# EAGLE design patch_nrd_ard (EAGLE 6.5.0)
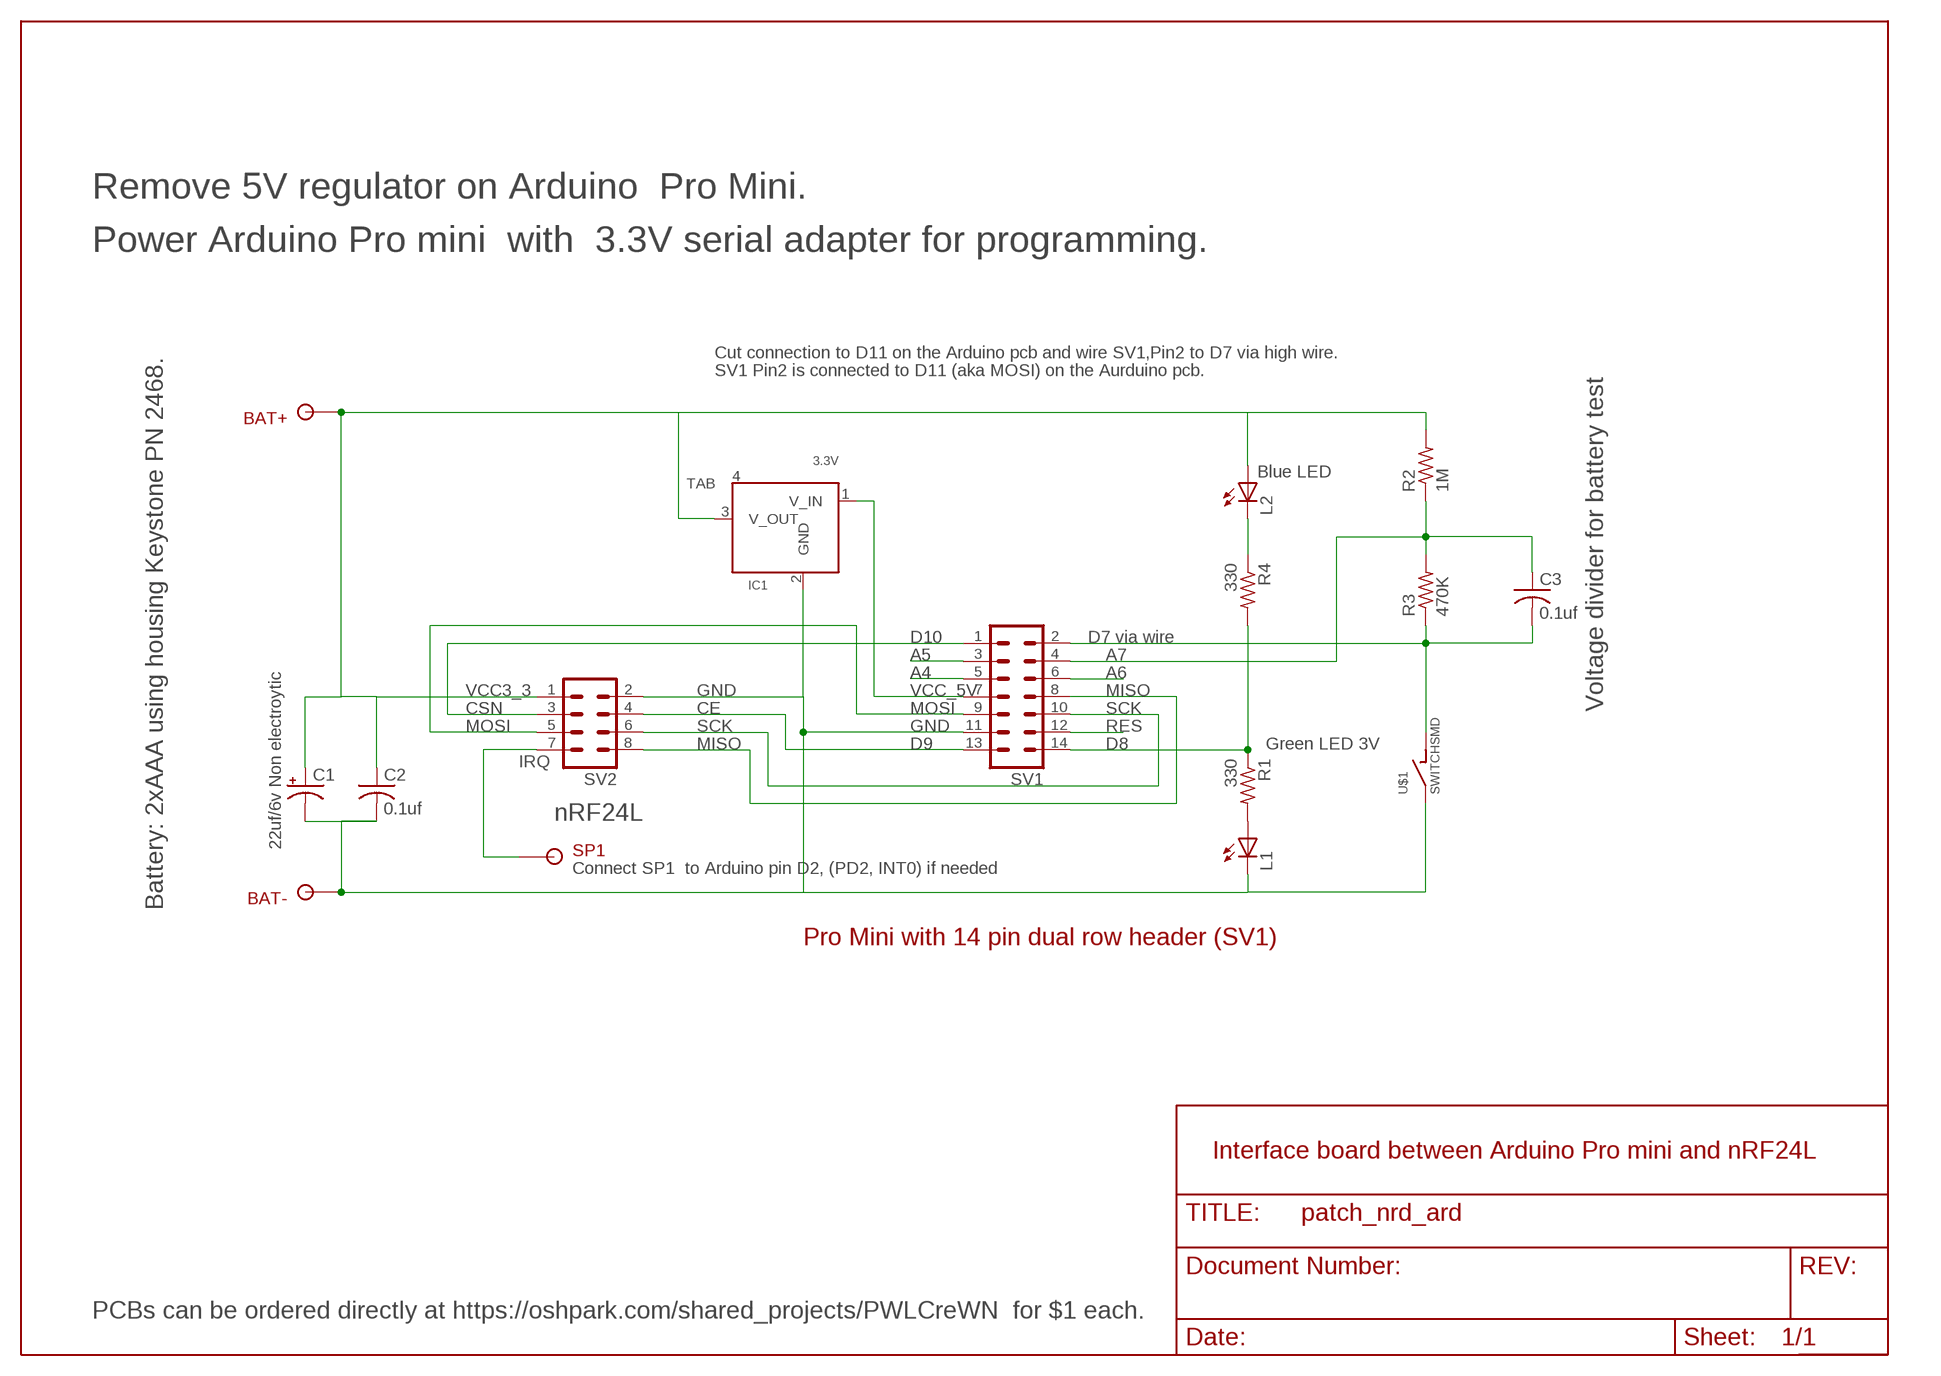
[diagram p0: schematic, sheet 1]

## Parts
BAT+  SOLDER_POINTA  [P1-13]
BAT-  SOLDER_POINTA  [P1-13]
C1  22uf/6v Non electroytic  CPOL-USSMCB  [SMC_B]
C2  0.1uf  C-USC0805  [C0805]
C3  0.1uf  C-USC0805  [C0805]
IC1  3.3V  MCP1703ASOT223  [SOT223]
L1  LEDSML0603  [SML0603]
L2  LEDSML0603  [SML0603]
R1  330  R-US_R0603  [R0603]
R2  1M  R-US_R0603  [R0603]
R3  470K  R-US_R0603  [R0603]
R4  330  R-US_R0603  [R0603]
SP1  SOLDER_POINTA  [P1-13]
SV1  MA07-2  [MA07-2]
SV2  MA04-2  [MA04-2]
U$1  SWITCHSMD  [SMD_SWITCH]

## Nets
A4: SV1.5
A5: SV1.3
A6: SV1.6
A7: C3.1 R2.1 R3.2 SV1.4
CE: SV1.13 SV2.4
CSN: SV1.1 SV2.3
D8: R1.1 R4.2 SV1.14
D11: C3.2 R3.1 SV1.2 U$1.P$1
GND: BAT-.1 C1.- C2.2 IC1.2(GND) L1.C SV1.11 SV2.2 U$1.P$2
IRQ: SP1.1 SV2.7
MISO: SV1.8 SV2.8
MOSI: SV1.9 SV2.5
N$1: L1.A R1.2
N$2: L2.C R4.1
RES: SV1.12
SCK: SV1.10 SV2.6
VCC3_3: BAT+.1 C1.+ C2.1 IC1.3(V_OUT) L2.A R2.2 SV2.1
VCC_5V: IC1.1(V_IN) SV1.7
Unconnected: IC1.4(TAB)

## Notes on the sheet
- Remove 5V regulator on Arduino  Pro Mini.
- Power Arduino Pro mini  with  3.3V serial adapter for programming.
- Cut connection to D11 on the Arduino pcb and wire SV1,Pin2 to D7 via high wire.
- SV1 Pin2 is connected to D11 (aka MOSI) on the Aurduino pcb. | Voltage divider for battery test
- Blue LED
- D10 | D7 via wire
- D9 | Green LED 3V
- nRF24L
- Connect SP1  to Arduino pin D2, (PD2, INT0) if needed
- Battery: 2xAAA using housing Keystone PN 2468.
- Pro Mini with 14 pin dual row header (SV1)
- Interface board between Arduino Pro mini and nRF24L
- PCBs can be ordered directly at https://oshpark.com/shared_projects/PWLCreWN  for $1 each.

## Library data of the parts
BAT+ BAT- SP1 = 1AA_Stofer:SOLDER_POINT
C1 = rcl:CPOL-US: POLARIZED CAPACITOR, American symbol
C2 C3 = rcl:C-US: CAPACITOR, American symbol
IC1 = 1AA_Stofer:MCP1703A
L1 L2 = led:LED: LED OSRAM: - CHIPLED LG R971, LG N971, LY N971, LG Q971, LY Q971, LO R971, LY R971 LH N974, LH R974 LS Q976, LO Q976, LY Q976 LO Q996 - Hyper CHIPLED LW Q18S LB Q993, LB Q99A, LB R99A - SideLED LS A670, LO A670, LY A670, LG A670, LP A670 LB A673, LV A673, LT A673, LW A673 LH A674 LY A675 LS A676, LA A676, LO A676, LY A676, LW A676 LS A679, LY A679, LG A679 - Hyper Micro SIDELED® LS Y876, LA Y876, LO Y876, LY Y876 LT Y87S - SmartLED LW L88C, LW L88S LB L89C, LB L89S, LG L890 LS L89K, LO L89K, LY L89K LS L896, LA L896, LO L896, LY L896 - TOPLED LS T670, LO T670, LY T670, LG T670, LP T670 LSG T670, LSP T670, LSY T670, LOP T670, LYG T670 LG T671, LOG T671, LSG T671 LB T673, LV T673, LT T673, LW T673 LH T674 LS T676, LA T676, LO T676, LY T676, LB T676, LH T676, LSB T676, LW T676 LB T67C, LV T67C, LT T67C, LS T67K, LO T67K, LY T67K, LW E67C LS E67B, LA E67B, LO E67B, LY E67B, LB E67C, LV E67C, LT E67C LW T67C LS T679, LY T679, LG T679 LS T770, LO T770, LY T770, LG T770, LP T770 LB T773, LV T773, LT T773, LW T773 LH T774 LS E675, LA E675, LY E675, LS T675 LS T776, LA T776, LO T776, LY T776, LB T776 LHGB T686 LT T68C, LB T68C - Hyper Mini TOPLED® LB M676 - Mini TOPLED Santana® LG M470 LS M47K, LO M47K, LY M47K Source: http://www.osram.convergy.de LUXEON: - LUMILED® LXK2-PW12-R00, LXK2-PW12-S00, LXK2-PW14-U00, LXK2-PW14-V00 LXK2-PM12-R00, LXK2-PM12-S00, LXK2-PM14-U00 LXK2-PE12-Q00, LXK2-PE12-R00, LXK2-PE12-S00, LXK2-PE14-T00, LXK2-PE14-U00 LXK2-PB12-K00, LXK2-PB12-L00, LXK2-PB12-M00, LXK2-PB14-N00, LXK2-PB14-P00, LXK2-PB14-Q00 LXK2-PR12-L00, LXK2-PR12-M00, LXK2-PR14-Q00, LXK2-PR14-R00 LXK2-PD12-Q00, LXK2-PD12-R00, LXK2-PD12-S00 LXK2-PH12-R00, LXK2-PH12-S00 LXK2-PL12-P00, LXK2-PL12-Q00, LXK2-PL12-R00 Source: www.luxeon.com KINGBRIGHT: KA-3528ASYC Source: www.kingbright.com
R1-R4 = rcl:R-US_: RESISTOR, American symbol
SV1 = con-lstb:MA07-2: PIN HEADER; OC_FARNELL: unknown; OC_NEWARK: unknown
SV2 = con-lstb:MA04-2: PIN HEADER; OC_FARNELL: unknown; OC_NEWARK: unknown
U$1 = 1AA_Stofer:SWITCH

## Board
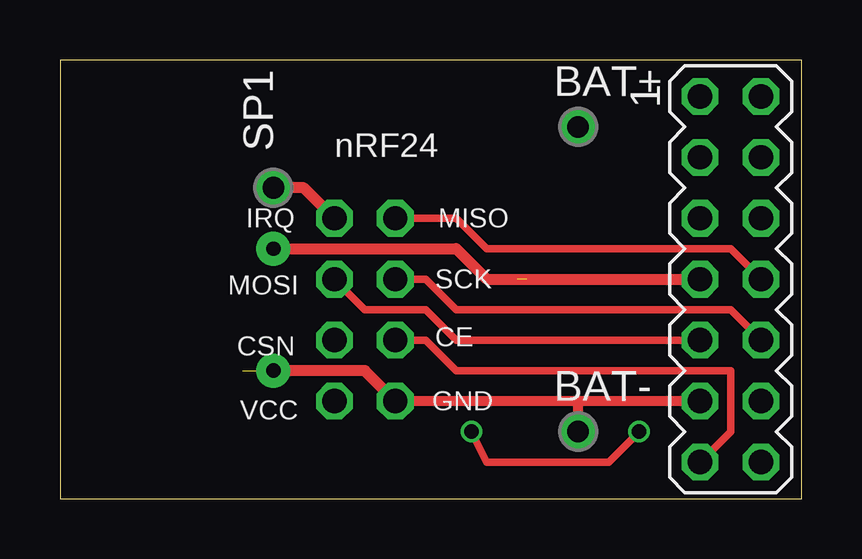
[diagram p1: board, top side]
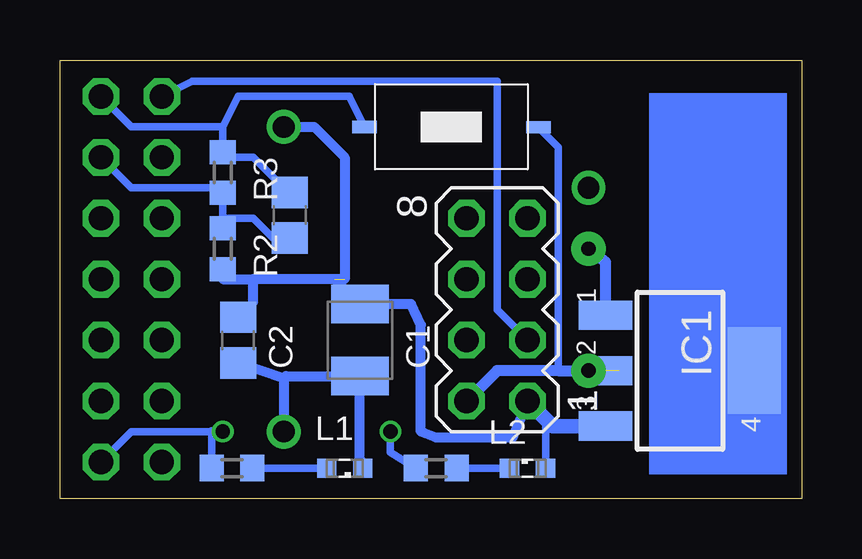
[diagram p2: board, bottom side, seen from below]

Size 30.91 x 18.28 mm. Coordinates in mm from the lower left corner, seen from the top.
Outline: 0,0 30.91,0 30.91,18.28 0,18.28 0,0
Copper layers (1*16): Top 0.035mm / dielectric 1.5mm / Bottom 0.035mm
Design rules "Elecrow_2-layer_eagle_rule": minimum track width 6mil, minimum drill 12mil, track to track 6mil, track to pad 6mil, pad to pad 6mil, via to via 6mil, smd to smd 0mil, copper to edge 10mil, drill to drill 10mil, minimum pad ring 10mil, minimum via ring 6mil, stop-mask expansion 2mil, vias tented up to drill 100mil, thermal gap 10mil

### Footprints (pad centres in the part's own frame; a part is rotated, then mirrored left to right if it is on the bottom)
P1-13 = drill 0.9: 1 0,0
SMC_B = smd 1.6 x 2.4: + -1.5,0; - 1.5,0
C0805 = smd 1.3 x 1.5: 1 -0.95,0; 2 0.95,0
SOT223 = smd 1.219 x 2.235: 1 -2.311,-3.099; 2 0,-3.099; 3 2.311,-3.099 | smd 3.6 x 2.2: 4 0,3.099
SML0603 = smd 0.8 x 0.8: A 0.75,0; C -0.75,0
R0603 = smd 1 x 1.1: 1 -0.85,0; 2 0.85,0
MA07-2 = drill 1.016 octagon: 1 -7.62,-1.27; 2 -7.62,1.27; 3 -5.08,-1.27; 4 -5.08,1.27; 5 -2.54,-1.27; 6 -2.54,1.27; 7 0,-1.27; 8 0,1.27; 9 2.54,-1.27; 10 2.54,1.27; 11 5.08,-1.27; 12 5.08,1.27; 13 7.62,-1.27; 14 7.62,1.27
MA04-2 = drill 1.016 octagon: 1 -3.81,-1.27; 2 -3.81,1.27; 3 -1.27,-1.27; 4 -1.27,1.27; 5 1.27,-1.27; 6 1.27,1.27; 7 3.81,-1.27; 8 3.81,1.27
SMD_SWITCH = smd 1.016 x 0.508: P$1 -4.259,-0.005; P$2 2.988,-0.021

### Placement (x,y rotation side)
BAT+  21.59,15.49 0 top
BAT-  21.59,2.79 0 top
C1  18.41,6.6 270 bottom
C2  23.49,6.6 270 bottom
C3  21.34,11.81 90 bottom
IC1  5.08,5.33 270 bottom
L1  19.05,1.27 180 bottom
L2  11.43,1.27 0 bottom
R1  23.75,1.27 0 bottom
R2  24.13,10.41 270 bottom
R3  24.13,13.59 270 bottom
R4  15.24,1.27 180 bottom
SP1  8.89,12.95 0 top
SV1  27.94,9.14 270 top
SV2  12.7,7.87 90 bottom
U$1  13.97,15.49 0 bottom

### Tracks (layer width: path | path; a pad name or v marks a point on that pad's centre or on a via)
A7
  Bottom 0.305: R2.1 24.13,11.68 | 24.13,11.68 R3.2 24.34,12.95 27.94,12.95 SV1.4 | 24.13,11.68 22.86,11.68 21.59,10.41 21.34,10.67 C3.1
CE
  Top 0.305: SV1.13 27.94,2.79 27.94,5.33 16.51,5.33 15.24,6.6 SV2.4
CSN
  Bottom 0.305: SV1.1 25.4,17.4 12.7,17.4 12.7,7.87 SV2.3
D8  (via drill 0.6)
  Top 0.305: v17.14,2.79 17.78,1.52 22.86,1.52 v24.13,2.79
  Bottom 0.305: R4.2 17.14,1.94 v17.14,2.79 | R1.1 24.6,2.83 v24.13,2.79 27.94,2.79 SV1.14
D11
  Bottom 0.305: 24.13,15.49 R3.1 23.91,14.22 22.86,14.22 21.4,12.76 C3.2 | 24.13,15.49 27.94,15.49 SV1.2 | U$1.P$1 18.87,16.76 23.49,16.76 24.13,15.49
GND  (via drill 0.6 pad 1.42)  (1 unrouted)
  Top 0.406: BAT-.1 21.59,4.06 | 21.59,4.06 SV2.2 | SV1.11 21.59,4.06
  Top 0.457: SV2.2 12.7,5.33 v8.89,5.33
  Bottom 0.305: U$1.P$2 10.16,14.65 10.16,5.33 | C1.- 18.41,4.06
  Bottom 0.406: C2.2 21.59,5.02 | 21.59,5.02 BAT-.1 | L1.C 18.3,1.52 18.41,1.64 C1.- 21.5,5.1 21.59,5.02
  Bottom 0.457: SV2.2 12.7,5.33 10.16,5.33 v8.89,5.33 7.62,5.33
IRQ
  Top 0.457: SV2.7 10.16,12.95 SP1.1
MISO
  Top 0.305: SV1.8 27.94,10.41 17.78,10.41 16.51,11.68 SV2.8
MOSI
  Top 0.305: SV1.9 16.51,6.6 15.24,7.87 12.7,7.87 SV2.5
N$1
  Bottom 0.305: L1.A R1.2
N$2
  Bottom 0.305: L2.C R4.1
SCK
  Top 0.305: SV1.10 27.94,7.87 16.51,7.87 15.24,9.14 SV2.6
VCC3_3  (1 unrouted)
  Bottom 0.305: R2.2 24.13,9.14 | C2.1 22.86,8.19 | L2.A 10.68,3.31 SV2.1
  Bottom 0.406: 24.13,9.14 22.86,9.14 | BAT+.1 20.32,15.49 19.05,14.22 19.05,9.14 22.86,9.14 | 20.32,9.14 19.45,9.14 C1.+ 16.28,8.1 15.88,7.24 15.88,2.79 15.24,2.54 12.06,2.54 SV2.1 | 22.86,8.19 22.86,9.14
  Bottom 0.61: IC1.3 10.39,3.02 SV2.1
VCC_5V  (via drill 0.6 pad 1.42)
  Top 0.457: v8.89,10.41 16.51,10.41 17.78,9.14 SV1.7
  Bottom 0.457: IC1.1 8.18,9.86 v8.89,10.41
(copper drawn outside any net)
  shapes: Bottom area x1

### Text on the board
tPlace: nRF24 | IRQ | MISO | MOSI | SCK | CE | CSN | VCC | GND